# Altium schematic sheet TFT_4.0-inch_OTM8009A_Sch.SchDoc: TFT_4.0-inch_OTM8009A
size 152 x 152 mm; Author: Hom; CompanyName: KitSprout; DrawnBy: Hom; Engineer: Hom; Organization: KitSprout; Revision: A; SheetNumber: 1; SheetTotal: 1; Version: 1.2; LibVersion: 1.2; PageSetup: Record=PageOptions|CenterHorizontal=True|CenterVertical=True|PrintScale=1.00|XCorrection=1.00|YCorrection=1.00|PrintKind=0|BorderSize=5000000|LeftOffset=0|BottomOffset=0|Orientation=2|PaperLength=1000|PaperWidth=1000|Scale=100|PaperSource=7|PrintQuality=-3|MediaType=1|DitherType=10|PrintScaleMode=0|PaperKind=A4|PaperIndex=9
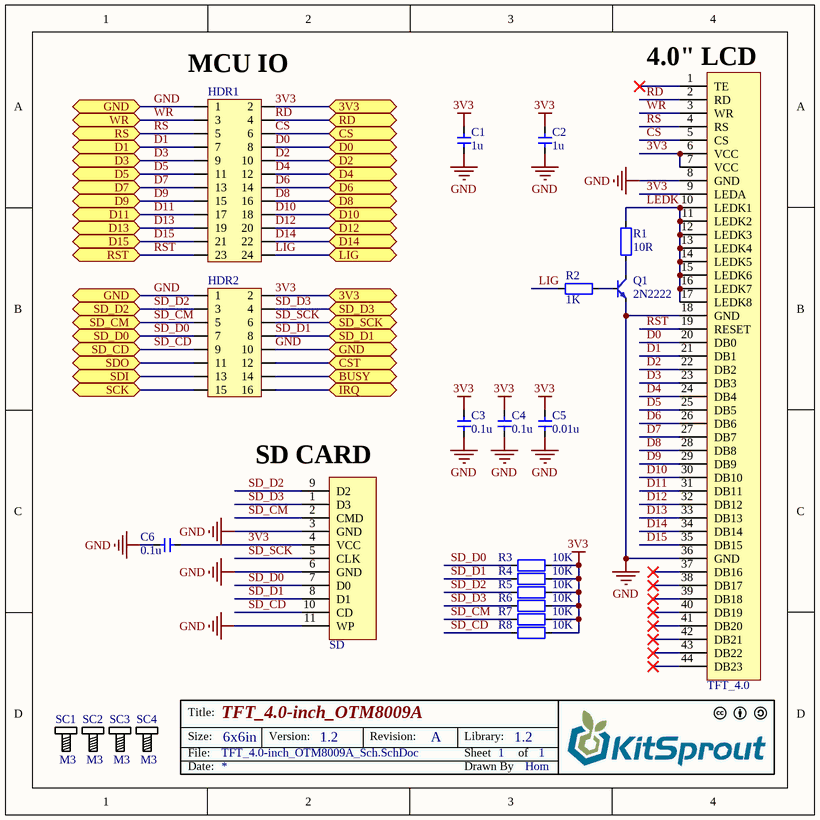
[diagram p0: TFT_4.0-inch_OTM8009A_Sch.SchDoc]

## Parts
C1  value 1u  [CAP_0603]  (hidden comment: Cap_0603)
C2  value 1u  [CAP_0603]  (hidden comment: Cap_0603)
C3  value 0.1u  [CAP_0603]  (hidden comment: Cap_0603)
C4  value 0.1u  [CAP_0603]  (hidden comment: Cap_0603)
C5  value 0.01u  [CAP_0603]  (hidden comment: Cap_0603)
C6  value 0.1u  [CAP_0603]  (hidden comment: Cap_0603)
HDR1  HDR2x12_2.54  [HDR2X12_2.54_180F]  (value not drawn)
HDR2  HDR2x8_2.54  [HDR2X8_2.54_180F]  (value not drawn)
Q1  BJT_NPN  [SOT23-3]  (value not drawn)
R1  value 10R  [RES_0603]  (hidden comment: Res_0603)
R2  value 1K  [RES_0603]  (hidden comment: Res_0603)
R3  value 10K  [RES_0603]  (hidden comment: Res_0603)
R4  value 10K  [RES_0603]  (hidden comment: Res_0603)
R5  value 10K  [RES_0603]  (hidden comment: Res_0603)
R6  value 10K  [RES_0603]  (hidden comment: Res_0603)
R7  value 10K  [RES_0603]  (hidden comment: Res_0603)
R8  value 10K  [RES_0603]  (hidden comment: Res_0603)
SC1  M3  [SCRREW_M3]
SC2  M3  [SCRREW_M3]
SC3  M3  [SCRREW_M3]
SC4  M3  [SCRREW_M3]
SD  SD_Card  [SD_Card_1]  (value not drawn)
TFT_4.0  TFT_4.0_OTM8009A  [TFT_4.0_800x480_OTM8009A]  (value not drawn)

## Ports
3V3, BUSY, CS, CST, D0, D1, D2, D3, D4, D5, D6, D7, D8, D9, D10, D11, D12, D13, D14, D15, GND, IRQ, LIG, RD, RS, RST, SCK, SD_CD, SD_CM, SD_D0, SD_D1, SD_D2, SD_D3, SD_SCK, SDI, SDO, WR

## Nets
3V3: C1.2 C2.2 C3.2 C4.2 C5.2 C6.1 HDR1.2 HDR2.2 R3.1 R4.1 R5.1 R6.1 R7.1 R8.1 SD.4(VCC) TFT_4.0.6(VCC) TFT_4.0.7(VCC) TFT_4.0.9(LEDA) ; port 3V3
GND: C1.1 C2.1 C3.1 C4.1 C5.1 C6.2 HDR1.1 HDR2.1 HDR2.10 Q1.2(E) SD.3(GND) SD.6(GND) SD.11(WP) TFT_4.0.8(GND) TFT_4.0.18(GND) TFT_4.0.36(GND) ; port GND
BUSY: HDR2.14 ; port BUSY
CS: HDR1.6 TFT_4.0.5(CS) ; port CS
CST: HDR2.12 ; port CST
D0: HDR1.8 TFT_4.0.20(DB0) ; port D0
D1: HDR1.7 TFT_4.0.21(DB1) ; port D1
D2: HDR1.10 TFT_4.0.22(DB2) ; port D2
D3: HDR1.9 TFT_4.0.23(DB3) ; port D3
D4: HDR1.12 TFT_4.0.24(DB4) ; port D4
D5: HDR1.11 TFT_4.0.25(DB5) ; port D5
D6: HDR1.14 TFT_4.0.26(DB6) ; port D6
D7: HDR1.13 TFT_4.0.27(DB7) ; port D7
D8: HDR1.16 TFT_4.0.28(DB8) ; port D8
D9: HDR1.15 TFT_4.0.29(DB9) ; port D9
D10: HDR1.18 TFT_4.0.30(DB10) ; port D10
D11: HDR1.17 TFT_4.0.31(DB11) ; port D11
D12: HDR1.20 TFT_4.0.32(DB12) ; port D12
D13: HDR1.19 TFT_4.0.33(DB13) ; port D13
D14: HDR1.22 TFT_4.0.34(DB14) ; port D14
D15: HDR1.21 TFT_4.0.35(DB15) ; port D15
IRQ: HDR2.16 ; port IRQ
LEDK: R1.2 TFT_4.0.10(LEDK1) TFT_4.0.11(LEDK2) TFT_4.0.12(LEDK3) TFT_4.0.13(LEDK4) TFT_4.0.14(LEDK5) TFT_4.0.15(LEDK6) TFT_4.0.16(LEDK7) TFT_4.0.17(LEDK8)
LIG: HDR1.24 R2.2 ; port LIG
RD: HDR1.4 TFT_4.0.2(RD) ; port RD
RS: HDR1.5 TFT_4.0.4(RS) ; port RS
RST: HDR1.23 TFT_4.0.19(RESET) ; port RST
SCK: HDR2.15 ; port SCK
SD_CD: HDR2.9 R8.2 SD.10(CD) ; port SD_CD
SD_CM: HDR2.5 R7.2 SD.2(CMD) ; port SD_CM
SD_D0: HDR2.7 R3.2 SD.7(D0) ; port SD_D0
SD_D1: HDR2.8 R4.2 SD.8(D1) ; port SD_D1
SD_D2: HDR2.3 R5.2 SD.9(D2) ; port SD_D2
SD_D3: HDR2.4 R6.2 SD.1(D3) ; port SD_D3
SD_SCK: HDR2.6 SD.5(CLK) ; port SD_SCK
SDI: HDR2.13 ; port SDI
SDO: HDR2.11 ; port SDO
WR: HDR1.3 TFT_4.0.3(WR) ; port WR
NetQ1_1: Q1.1(B) R2.1
NetQ1_3: Q1.3(C) R1.1

Not connected (* = marked no-connect by the designer): TFT_4.0 1(TE)* 37(DB16)* 38(DB17)* 39(DB18)* 40(DB19)* 41(DB20)* 42(DB21)* 43(DB22)* 44(DB23)*

## Notes on the sheet
- (near HDR1) MCU IO
- (near TFT_4.0) 4.0" LCD
- (near SD) SD CARD
- Title:
- Size:
- Date:
- File:
- 6x6in
- Version:
- Revision:
- Sheet
- Drawn By
- Library:
- of
- (in symbol BJT_NPN) 2N2222

## Library data of the parts
C1-C6 = Cap_0603: Capacitor
HDR1 = HDR2x12_2.54: Header
HDR2 = HDR2x8_2.54: Header
Q1 = BJT_NPN: Transistor
R1-R8 = Res_0603: Resistor
SC1-SC4 = Screw_M3: Screw
SD = SD_Card: SD
TFT_4.0 = TFT_4.0_OTM8009A: TFT